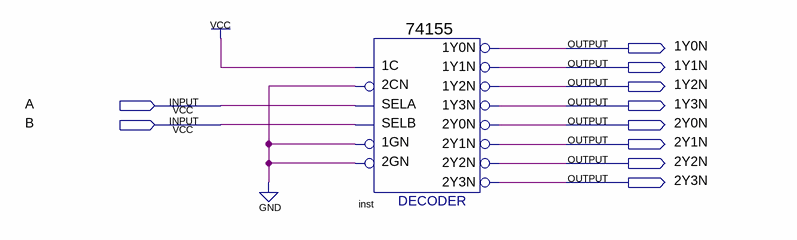
[diagram p0: schematic sheet]
// Quartus schematic Question1.bdf as structural Verilog: 1 symbols, 10 pins
module Question1 (
  input  A,
  input  B,
  output \1Y0N ,
  output \1Y1N ,
  output \1Y2N ,
  output \1Y3N ,
  output \2Y0N ,
  output \2Y1N ,
  output \2Y2N ,
  output \2Y3N 
);

  \74155  inst (
    .\1C (1'b1), .\2CN (1'b0), .SELB(B), .SELA(A), .\1GN (1'b0), .\2GN (1'b0), .\1Y2N (\1Y2N ),
    .\1Y1N (\1Y1N ), .\1Y0N (\1Y0N ), .\2Y1N (\2Y1N ), .\2Y0N (\2Y0N ), .\1Y3N (\1Y3N ), .\2Y3N (\2Y3N ),
    .\2Y2N (\2Y2N ));
endmodule
